# EAGLE design Automotive_Inter_BoB (EAGLE 9.5.2)
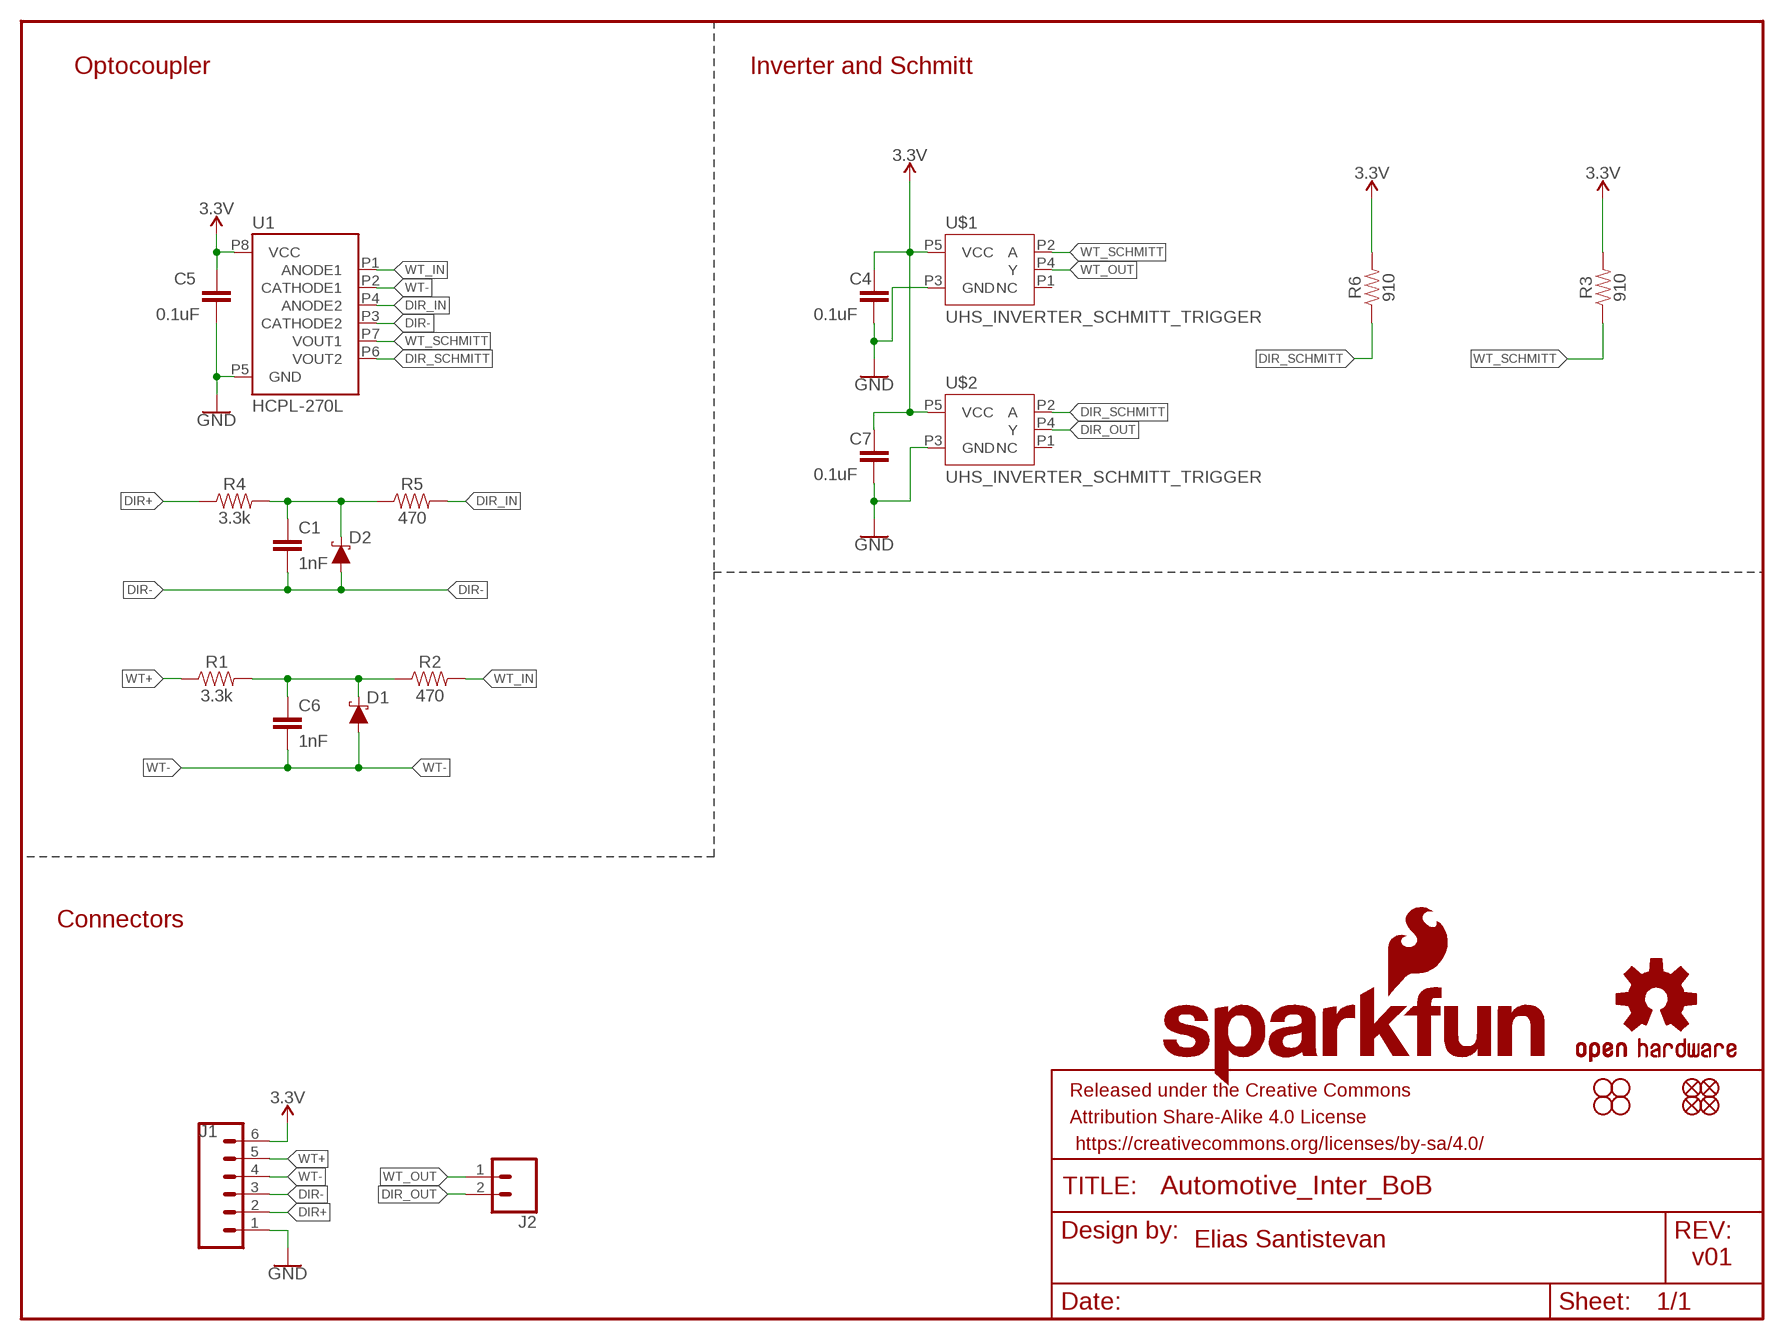
[diagram p0: schematic, sheet 1]

## Parts
C1  1nF  1.0NF/1000PF-0603-50V-10%  [0603]
C4  0.1uF  0.1UF-0603-100V-10%  [0603]
C5  0.1uF  0.1UF-0603-100V-10%  [0603]
C6  1nF  1.0NF/1000PF-0603-50V-10%  [0603]
C7  0.1uF  0.1UF-0603-100V-10%  [0603]
D1  0.5A/40V/420mV  DIODE-SCHOTTKY-PMEG4005EJ  [SOD-323]
D2  0.5A/40V/420mV  DIODE-SCHOTTKY-PMEG4005EJ  [SOD-323]
FD1  FIDUCIALUFIDUCIAL  [FIDUCIAL-MICRO]
FD2  FIDUCIALUFIDUCIAL  [FIDUCIAL-MICRO]
FD3  FIDUCIALUFIDUCIAL  [FIDUCIAL-MICRO]
FD4  FIDUCIALUFIDUCIAL  [FIDUCIAL-MICRO]
FRAME1  FRAME-LETTER  [CREATIVE_COMMONS]
H1  STAND-OFF  [STAND-OFF]
H2  STAND-OFF  [STAND-OFF]
H3  STAND-OFF  [STAND-OFF]
H4  STAND-OFF  [STAND-OFF]
J1  CONN_06NO_SILK_NO_POP  [1X06_NO_SILK]
J2  CONN_021X02_NO_SILK  [1X02_NO_SILK]
LOGO1  SFE_LOGO_NAME_FLAME.1_INCH  [SFE_LOGO_NAME_FLAME_.1]
LOGO2  OSHW-LOGOS  [OSHW-LOGO-S]
R1  3.3k  3.3KOHM-0603-1/10W-1%  [0603]
R2  470  470OHM-0603-1/10W-1%  [0603]
R3  910  910OHM-0603-1/10W-5%  [0603]
R4  3.3k  3.3KOHM-0603-1/10W-1%  [0603]
R5  470  470OHM-0603-1/10W-1%  [0603]
R6  910  910OHM-0603-1/10W-5%  [0603]
U1  HCPL-270L  [SOP_8-PIN]
U$1  UHS_INVERTER_SCHMITT_TRIGGER  [SC-74A]
U$2  UHS_INVERTER_SCHMITT_TRIGGER  [SC-74A]

## Nets
3.3V: C4.1 C5.1 C7.1 J1.6 R3.2 R6.2 U1.P8(VCC) U$1.P5(VCC) U$2.P5(VCC)
DIR+: J1.2 R4.1
DIR-: C1.2 D2.A J1.3 U1.P3(CATHODE2)
DIR_IN: R5.2 U1.P4(ANODE2)
DIR_OUT: J2.2 U$2.P4(Y)
DIR_SCHMITT: R6.1 U1.P6(VOUT2) U$2.P2(A)
GND: C4.2 C5.2 C7.2 J1.1 U1.P5(GND) U$1.P3(GND) U$2.P3(GND)
N$2: C6.1 D1.C R1.2 R2.1
N$3: C1.1 D2.C R4.2 R5.1
WT+: J1.5 R1.1
WT-: C6.2 D1.A J1.4 U1.P2(CATHODE1)
WT_IN: R2.2 U1.P1(ANODE1)
WT_OUT: J2.1 U$1.P4(Y)
WT_SCHMITT: R3.1 U1.P7(VOUT1) U$1.P2(A)
Unconnected: U$1.P1(NC) U$2.P1(NC)

## Notes on the sheet
- Optocoupler | Inverter and Schmitt
- Connectors
- Elias Santistevan
- v01

## Library data of the parts
C1 C6 = SparkFun-Capacitors:1.0NF/1000PF: 1nF/1,000pF ceramic capacitors A capacitor is a passive two-terminal electrical component used to store electrical energy temporarily in an electric field.; PROD_ID: CAP-07886
C4 C5 C7 = SparkFun-Capacitors:0.1UF: 0.1µF ceramic capacitors A capacitor is a passive two-terminal electrical component used to store electrical energy temporarily in an electric field.; PROD_ID: CAP-08390
D1 D2 = SparkFun-DiscreteSemi:DIODE-SCHOTTKY: Schottky diode A Schottky diode is a semiconductor diode which has a low forward voltage drop and a very fast switching action.; PROD_ID: DIO-10955
FD1-FD4 = SparkFun-Aesthetics:FIDUCIAL: Fiducial Alignment Points Point-of-reference for pick-and-place machines and other optical instruments.
FRAME1 = SparkFun-Aesthetics:FRAME-LETTER: Schematic Frame - Letter Standard 8.5x11 US Letter frame
H1-H4 = SparkFun-Hardware:STAND-OFF: Stand Off Drill holes for mechanically mounting via screws, standoffs, etc. Note: Use the keepout ring to avoid running the screw head into surrounding components. Variant Overviews STAND-OFF - Mechanical footprint for a #4 phillips button head screw. STAND-OFF-TIGHT - Mechanical footprint for a #4 phillips button head screw, Example SparkFun Products Screw - Phillips Head (1/4", 4-40, 10 pack) <https://www.sparkfun.com/products/10453> (PRT-10453) Screw - Phillips Head (1/2", 4-40, 10 pack) <https://www.sparkfun.com/products/10452> (PRT-10452) Screw - Phillips Head (3/4", 4-40, 10 pack) <https://www.sparkfun.com/products/10451> (PRT-10451) Screw - Phillips Head (1", 4-40, 10 pack) <https://www.sparkfun.com/products/10450> (PRT-10450)
J1 = SparkFun-Connectors:CONN_06: Multi connection point. Often used as Generic Header-pin footprint for 0.1 inch spaced/style header connections On any of the 0.1 inch spaced packages, you can populate with these: Break Away Headers - Straight <https://www.sparkfun.com/products/116> (PRT-00116) Break Away Male Headers - Right Angle <https://www.sparkfun.com/products/553> (PRT-00553) Female Headers <https://www.sparkfun.com/products/115> (PRT-00115) Break Away Headers - Machine Pin <https://www.sparkfun.com/products/117> (PRT-00117) Break Away Female Headers - Swiss Machine Pin <https://www.sparkfun.com/products/743> (PRT-00743) Arduino Stackable Header - 6 Pin <https://www.sparkfun.com/products/9280> (PRT-09280) For SCREWTERMINALS and SPRING TERMINALS visit here: Screw Terimnals on SparkFun.com <https://www.sparkfun.com/search/results?term=Screw+Terminals> (5mm/3.5mm/2.54mm spacing) This device is also useful as a general connection point to wire up your design to another part of your project. Our various solder wires solder well into these plated through hole pads. Hook-Up Wire - Assortment (Stranded, 22 AWG) <https://www.sparkfun.com/products/11375> (PRT-11375) Hook-Up Wire - Assortment (Solid Core, 22 AWG) <https://www.sparkfun.com/products/11367> (PRT-11367) View the entire wire category on our website here <https://www.sparkfun.com/categories/141>
J2 = SparkFun-Connectors:CONN_02: Multi connection point. Often used as Generic Header-pin footprint for 0.1 inch spaced/style header connections On any of the 0.1 inch spaced packages, you can populate with these: Break Away Headers - Straight <https://www.sparkfun.com/products/116> (PRT-00116) Break Away Male Headers - Right Angle <https://www.sparkfun.com/products/553> (PRT-00553) Female Headers <https://www.sparkfun.com/products/115> (PRT-00115) Break Away Headers - Machine Pin <https://www.sparkfun.com/products/117> (PRT-00117) Break Away Female Headers - Swiss Machine Pin <https://www.sparkfun.com/products/743> (PRT-00743) For SCREWTERMINALS and SPRING TERMINALS visit here: Screw Terimnals on SparkFun.com <https://www.sparkfun.com/search/results?term=Screw+Terminals> (5mm/3.5mm/2.54mm spacing) This device is also useful as a general connection point to wire up your design to another part of your project. Our various solder wires solder well into these plated through hole pads. Hook-Up Wire - Assortment (Stranded, 22 AWG) <https://www.sparkfun.com/products/11375> (PRT-11375) Hook-Up Wire - Assortment (Solid Core, 22 AWG) <https://www.sparkfun.com/products/11367> (PRT-11367) View the entire wire category on our website here <https://www.sparkfun.com/categories/141> Special notes: Molex polarized connector foot print use with: PRT-08233 with associated crimp pins and housings. 2.54_SCREWTERM for use with PRT-10571. 3.5mm Screw Terminal footprints for PRT-08084 5mm Screw Terminal footprints for use with PRT-08432
LOGO1 = SparkFun-Aesthetics:SFE_LOGO_NAME_FLAME: SparkFun Font Logo w/ Flame This is the SparkFun full logo. The logo on the schematic will always be the same size; the package variant is the height of the flame part of the logo. Default layer for the logo on the board is tSilk.
LOGO2 = SparkFun-Aesthetics:OSHW-LOGO: Open-Source Hardware (OSHW) Logo This logo indicates the piece of hardware it is found on incorporates a OSHW license and/or adheres to the definition of open source hardware found here: http://freedomdefined.org/OSHW
R1 R4 = SparkFun-Resistors:3.3KOHM: 3.3kΩ resistor A resistor is a passive two-terminal electrical component that implements electrical resistance as a circuit element. Resistors act to reduce current flow, and, at the same time, act to lower voltage levels within circuits. - Wikipedia; PROD_ID: RES-07851
R2 R5 = SparkFun-Resistors:470OHM: 470Ω resistor A resistor is a passive two-terminal electrical component that implements electrical resistance as a circuit element. Resistors act to reduce current flow, and, at the same time, act to lower voltage levels within circuits. - Wikipedia; PROD_ID: RES-07869
R3 R6 = classified:910OHM-0603-1/10W-5%: 910 Ohm Resistor Digikey Link <https://www.digikey.com/product-detail/en/yageo/RC0603JR-07910RL/311-910GRTR-ND/726838>
U1 = classified:HCPL-270L: HCPL-270L These high gain series couplers use a Light Emitting Diode and an integrated high gain photodetector to provide extremely high current transfer ratio between input and output. Separate pins for the photodiode and output stage result in LVTTL compatible saturation voltages and high speed operation. Where desired, the VCC and VO terminals may be tied together to achieve conventional photo-darlington operation. A base access terminal allows a gain bandwidth adjustment to be made. These optocouplers are for use in LVTTL/LVCMOS or other low power applications. A 400% minimum current transfer ratio is guaranteed over 0 to +70˚C operating range for only 0.5 mA of LED current. Digikey Link <https://www.digikey.com/products/en?mpart=HCPL-070L-500E&v=516>
U$1 U$2 = classified:UHS_INVERTER_SCHMITT_TRIGGER: NC7SZ14 The NC7SZ14 is a single inverter with Schmitt trigger input from ON Semiconductor’s Ultra−High Speed (UHS) series of TinyLogic. The device is fabricated w ith advanced CMOS technology to achieve ultra−high speed with high output drive while maintaining low static power dissipation over a very broad VCC operating range. The device is specified to operate over the 1.65 V to 5.5 V VCC range. The inputs and outputs are high−impedance when VCC is 0 V. Inputs tolerate voltages up to 5.5 V independent of VCC operating voltage. Digikey Link <https://www.digikey.com/product-detail/en/on-semiconductor/NC7SZ14M5X/NC7SZ14M5XDKR-ND/1628606>

## Board
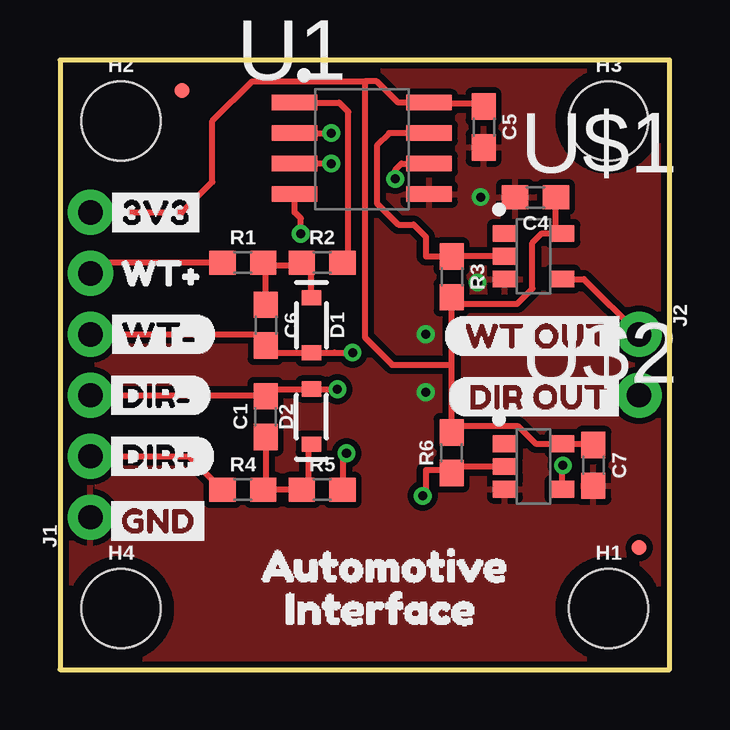
[diagram p1: board, top side]
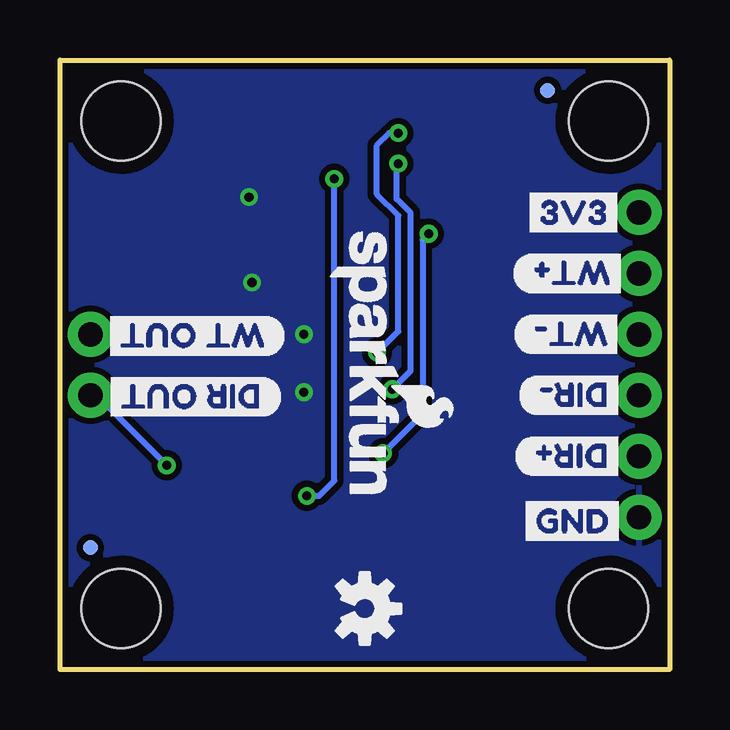
[diagram p2: board, bottom side, seen from below]

Size 25.4 x 25.4 mm. Coordinates in mm from the lower left corner, seen from the top.
Outline: 0,0 25.4,0 25.4,25.4 0,25.4 0,0
Copper layers (1*16): Top 0.035mm / dielectric 1.5mm / Bottom 0.035mm
Design rules "SparkFun-2-layer-TIGHT": minimum track width 7mil, minimum drill 15mil, track to track 7mil, track to pad 7mil, pad to pad 7mil, via to via 7mil, smd to smd 7mil, copper to edge 7mil, drill to drill 7mil, minimum pad ring 7mil, minimum via ring 7mil, stop-mask expansion 4mil, vias tented up to drill 25mil, thermal gap 10mil

### Footprints (pad centres in the part's own frame; a part is rotated, then mirrored left to right if it is on the bottom)
0603 = smd 1.1 x 1: 1 -0.85,0; 2 0.85,0
SOD-323 = smd 0.63 x 0.83: A 1.15,0; C -1.15,0
FIDUCIAL-MICRO = smd 0.635 x 0.635: 1 0,0
STAND-OFF = hole 3.302: 0,0
1X06_NO_SILK = drill 1.016 pad 1.88: 1 0,0; 2 2.54,0; 3 5.08,0; 4 7.62,0; 5 10.16,0; 6 12.7,0
1X02_NO_SILK = drill 1.016 pad 1.88: 1 0,0; 2 2.54,0
SOP_8-PIN = smd 1.9 x 0.64: P1 -2.921,2.032; P2 -2.921,0.762; P3 -2.921,-0.508; P4 -2.921,-1.778; P5 2.679,-1.778; P6 2.679,-0.508; P7 2.679,0.762; P8 2.679,2.032
SC-74A = smd 1 x 0.7: P1 -1.151,0.903; P2 -1.151,-0.047; P3 -1.151,-0.997; P4 1.249,-0.997; P5 1.249,0.903

### Placement (x,y rotation side)
C1  8.57,10.54 90 top
C4  19.81,19.68 180 top
C5  17.65,22.61 270 top
C6  8.57,14.35 270 top
C7  22.23,8.51 270 top
D1  10.48,14.35 270 top
D2  10.48,10.54 90 top
FD1  24.13,5.08 0 bottom
FD2  5.08,24.13 0 bottom
FD3  5.08,24.13 0 top
FD4  24.13,5.08 0 top
FRAME1  8.89,-21.59 0 top  (outside the outline)
H1  22.86,2.54 0 top
H2  2.54,22.86 0 top
H3  22.86,22.86 0 top
H4  2.54,2.54 0 top
J1  1.27,6.35 90 top
J2  24.13,13.97 270 top
LOGO1  12.7,12.7 270 bottom
LOGO2  12.7,2.54 270 bottom
R1  7.62,16.95 0 top
R2  10.92,16.95 0 top
R3  16.32,16.36 270 top
R4  7.62,7.49 0 top
R5  10.92,7.49 0 top
R6  16.32,9.04 90 top
U1  12.7,21.59 0 top
U$1  19.68,17.27 0 top
U$2  19.68,8.51 0 top
U$3  [DIR#2]  1.65,11.43 0 top
U$4  [DIR#3]  1.65,8.89 0 top
U$5  [WT#1]  1.65,13.97 0 top
U$6  [WT#0]  1.65,16.51 0 top
U$7  [WT_OUT4]  15.94,13.91 0 top
U$8  [DIR_OUT5]  16.13,11.37 0 top
U$9  [AUTOMOTIVE6]  7.24,4.32 0 top
U$10  [INTERFACE7]  8.26,2.54 0 top
U$11  [DIR#2]  1.65,11.43 180 bottom
U$12  [DIR#3]  1.65,8.89 180 bottom
U$13  [DIR_OUT5]  16.13,11.37 180 bottom
U$14  [WT#0]  1.52,16.51 180 bottom
U$15  [WT#1]  1.65,13.97 180 bottom
U$16  [WT_OUT4]  15.94,13.91 180 bottom
U$17  [3V3-04]  1.65,19.05 0 top
U$18  [GND-04]  1.65,6.2 0 top
U$19  [3V3-04]  6.35,19.05 0 bottom
U$20  [GND-04]  6.48,6.2 0 bottom

### Tracks (layer width: path | path; a pad name or v marks a point on that pad's centre or on a via)
3.3V
  Top 0.254: 12.7,24.51 8,24.51 6.35,22.86 6.35,20.32 5.08,19.05 J1.6 | 12.7,24.51 13.21,24.51 14.1,23.62 U1.P8 15.42,23.58 17.53,23.58 C5.1 | 16.32,12.7 R6.2 16.59,10.16 19.07,10.16 19.82,9.41 U$2.P5 22.17,9.41 C7.1 | 16.32,12.7 R3.2 | 12.7,24.51 12.7,13.84 13.84,12.7 16.32,12.7 | R3.2 16.47,15.37 | R3.2 16.59,15.24 19.05,15.24 19.68,15.88 19.68,17.78 20.08,18.18 U$1.P5 20.66,18.45 C4.1
DIR+
  Top 0.254: J1.2 5.37,8.89 R4.1
DIR-  (via drill 0.38)
  Top 0.254: J1.3 8.53,11.43 C1.2 8.87,11.69 D2.A 11.55,11.69 v11.56,11.68 | v11.3,21.08 U1.P3
  Bottom 0.254: v11.56,11.68 10.79,12.45 10.79,19.03 11.38,19.61 11.38,21.01 v11.3,21.08
DIR_IN  (via drill 0.38)
  Top 0.254: v11.94,9.02 11.77,8.85 R5.2 | v10.03,18.16 10.03,18.8 9.97,18.86 9.78,19.05 U1.P4
  Bottom 0.254: v11.94,9.02 10.29,10.67 10.29,17.91 v10.03,18.16
DIR_OUT  (via drill 0.38)
  Top 0.254: U$2.P4 20.93,8.49 v20.95,8.51
  Bottom 0.254: v20.95,8.51 23.88,11.43 J2.2
DIR_SCHMITT  (via drill 0.38)
  Top 0.254: U$2.P2 16.59,8.46 R6.1 16.19,8.31 15.24,8.31 15.24,7.37 v15.11,7.24 | v13.97,20.45 13.97,20.83 14.22,21.08 U1.P6
  Bottom 0.254: v13.97,20.45 13.97,7.87 14.61,7.24 v15.11,7.24
GND  (via drill 0.38)
  other vias: 17.53,19.68 15.24,13.97 15.24,11.56 17.4,16.13
  pour Top (isolate 0.254): 0,25.4 25.4,25.4 25.4,0 0,0
  pour Bottom (isolate 0.254): 0,25.4 0,0 25.4,0 25.4,25.4
N$2
  Top 0.254: C6.1 8.57,16.85 | D1.C 10.48,16.85 9.97,16.85 | 9.97,16.85 R2.1 | R1.2 8.57,16.85 | 8.57,16.85 9.97,16.85
N$3
  Top 0.254: C1.1 8.57,7.6 R4.2 R5.1 10.35,7.77 10.35,9.26 D2.C
WT+
  Top 0.254: R1.1 1.71,16.95 J1.5
WT-  (via drill 0.38)
  Top 0.254: J1.4 8.1,13.97 C6.2 8.87,13.2 D1.A 11.42,13.2 11.43,13.21 v12.19,13.21 | U1.P2 v11.3,22.35
  Bottom 0.254: v11.3,22.35 11.68,22.35 12.19,21.84 12.19,19.81 11.3,18.92 11.3,14.1 v12.19,13.21
WT_IN
  Top 0.254: R2.2 12.01,17.2 12.01,23.24 11.63,23.62 U1.P1
WT_OUT
  Top 0.254: U$1.P4 21.82,16.27 J2.1
WT_SCHMITT
  Top 0.254: U$1.P2 R3.1 15.24,17.21 15.24,18.03 14.73,18.54 14.1,18.54 13.21,19.43 13.21,21.84 13.72,22.35 U1.P7